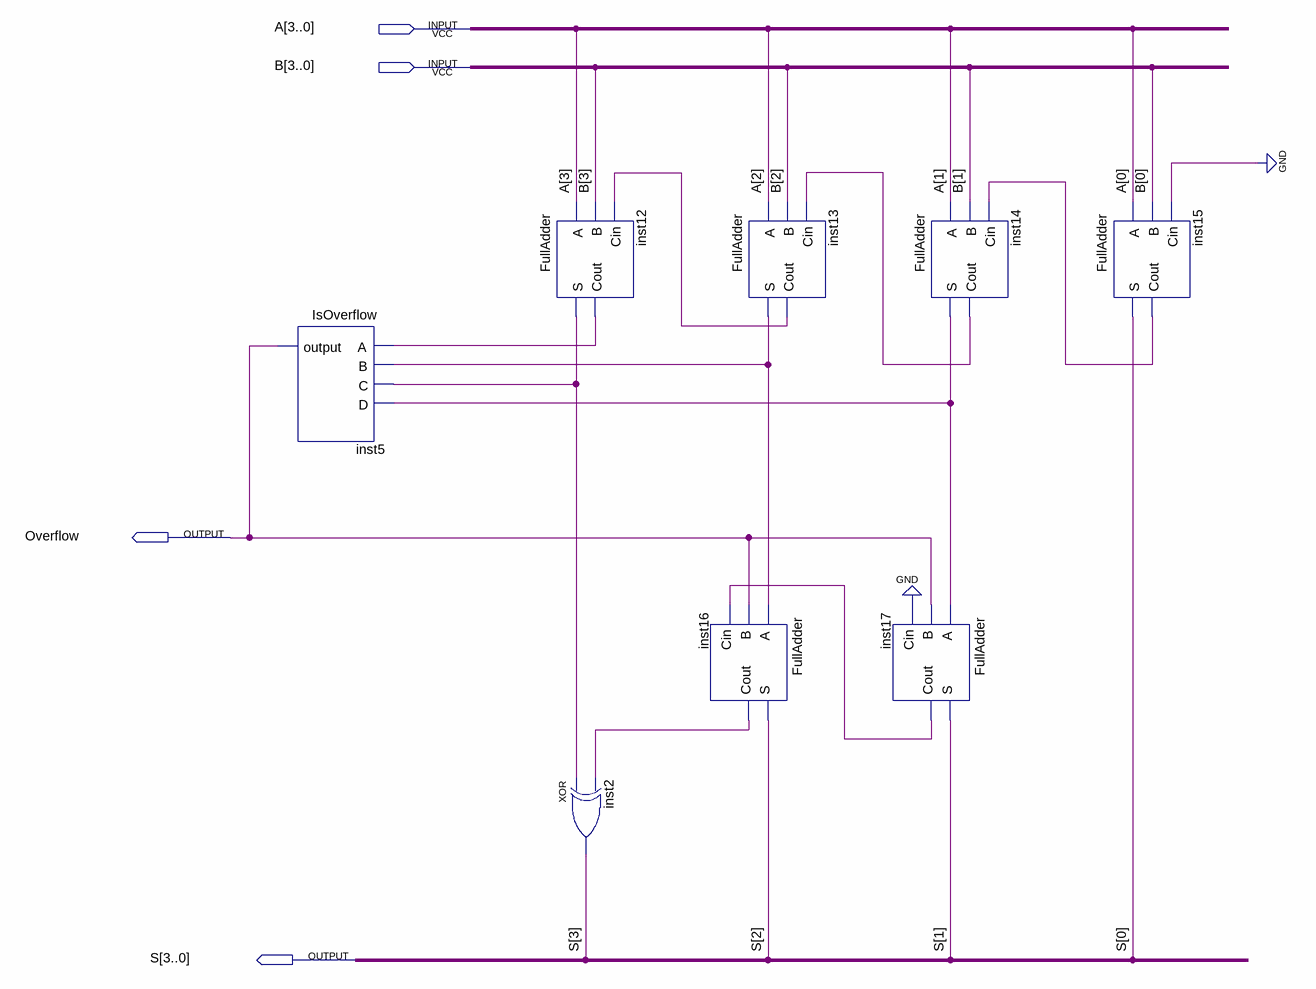
[diagram p0: schematic sheet]
// Quartus schematic Somador_BCD.bdf as structural Verilog: 8 symbols, 4 pins
module Somador_BCD (
  input  [3:0] A,
  input  [3:0] B,
  output Overflow,
  output [3:0] S
);

  wire inst12_cout, inst12_s, inst13_cout, inst13_s, inst14_cout, inst14_s, inst15_cout, inst16_cout,
       inst17_cout;

  IsOverflow inst5 (.A(inst12_cout), .B(inst13_s), .C(inst12_s), .D(inst14_s), .\output (Overflow));
  FullAdder inst12 (.A(A[3]), .B(B[3]), .Cin(inst13_cout), .S(inst12_s), .Cout(inst12_cout));
  xor inst2 (S[3], inst12_s, inst16_cout);
  FullAdder inst16 (.A(inst13_s), .B(Overflow), .Cin(inst17_cout), .S(S[2]), .Cout(inst16_cout));
  FullAdder inst13 (.A(A[2]), .B(B[2]), .Cin(inst14_cout), .S(inst13_s), .Cout(inst13_cout));
  FullAdder inst14 (.A(A[1]), .B(B[1]), .Cin(inst15_cout), .S(inst14_s), .Cout(inst14_cout));
  FullAdder inst17 (.A(inst14_s), .B(Overflow), .Cin(1'b0), .S(S[1]), .Cout(inst17_cout));
  FullAdder inst15 (.A(A[0]), .B(B[0]), .Cin(1'b0), .S(S[0]), .Cout(inst15_cout));
endmodule
